# EAGLE design nRF52810 Beacon (EAGLE 9.6.2)
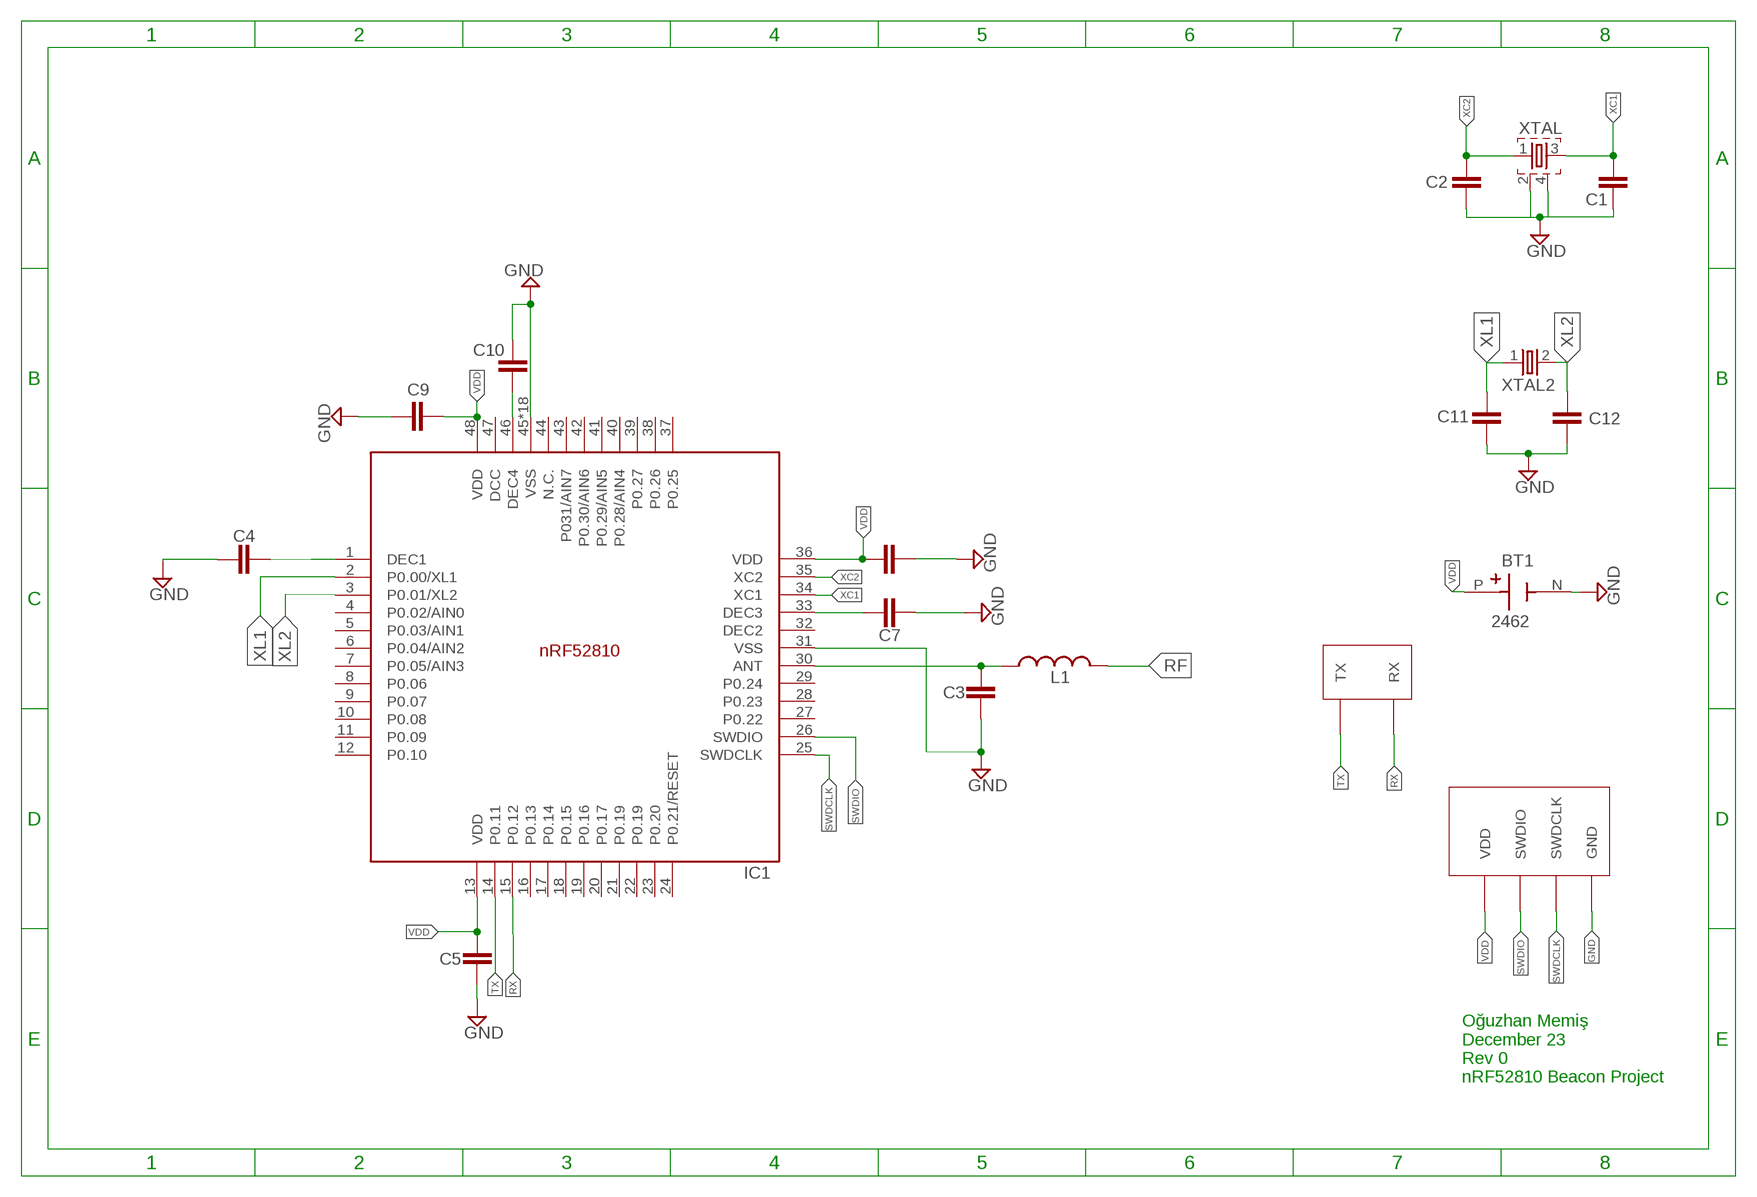
[diagram p0: schematic, sheet 1]

## Parts
BT1  2462  [BAT_2462]
C1  12pF  CAPACITOR_0402_N  [RESC0402_N]
C2  12pF  CAPACITOR_0402_N  [RESC0402_N]
C3  0.8pF  CAPACITOR_0402_N  [RESC0402_N]
C4  100nF  CAPACITOR_0402_N  [RESC0402_N]
C5  100nF  CAPACITOR_0402_N  [RESC0402_N]
C7  100pF  CAPACITOR_0402_N  [RESC0402_N]
C8  100nF  CAPACITOR_0402_N  [RESC0402_N]
C9  4.7uF  CAPACITOR_0603_N  [RESC0603_N]
C10  1uF  CAPACITOR_0603_N  [RESC0603_N]
C11  12pF  CAPACITOR_0402_N  [RESC0402_N]
C12  12pF  CAPACITOR_0402_N  [RESC0402_N]
IC1  NRF52810_QF48  [QFN40P600X600X90-48_N]
L1  3.9nF  INDUCTOR_0402_N  [RESC0402_N]
U$1  SWD  [SWD]
U$2  UART  [UART]
XTAL  32MHz SMD2016  XTAL_32MHZ  [BT-XTAL_2016_N]
XTAL2  32KHz  XTAL_32KHZ  [XTAL_3215_N]

## Nets
GND: BT1.N(NEG) C1.1 C2.1 C3.2 C4.1 C5.2 C7.2 C8.2 C9.1 C10.2 C11.1 C12.1 IC1.31(VSS) IC1.45(VSS) IC1.PAD(VSS) IC1.PAD@VIA01(VSS) IC1.PAD@VIA02(VSS) IC1.PAD@VIA03(VSS) IC1.PAD@VIA04(VSS) IC1.PAD@VIA05(VSS) IC1.PAD@VIA06(VSS) IC1.PAD@VIA07(VSS) IC1.PAD@VIA08(VSS) IC1.PAD@VIA09(VSS) IC1.PAD@VIA10(VSS) IC1.PAD@VIA11(VSS) IC1.PAD@VIA12(VSS) IC1.PAD@VIA13(VSS) IC1.PAD@VIA14(VSS) IC1.PAD@VIA15(VSS) IC1.PAD@VIA16(VSS) U$1.GND XTAL.2 XTAL.4
N$1: C10.1 IC1.46(DEC4)
N$3: C7.1 IC1.33(DEC3)
N$6: C4.2 IC1.1(DEC1)
N$11: C3.1 IC1.30(ANT) L1.1
RF: L1.2
RX: IC1.15(P0.12) U$2.RX
SWDCLK: IC1.25(SWDCLK) U$1.SWDCLK
SWDIO: IC1.26(SWDIO) U$1.SWDIO
TX: IC1.14(P0.11) U$2.TX
VDD: BT1.P(POS) C5.1 C8.1 C9.2 IC1.13(VDD) IC1.36(VDD) IC1.48(VDD) U$1.VDD
XC1: C1.2 IC1.34(XC1) XTAL.3
XC2: C2.2 IC1.35(XC2) XTAL.1
XL1: C11.2 IC1.2(P0.00/XL1) XTAL2.1
XL2: C12.2 IC1.3(P0.01/XL2) XTAL2.2
Unconnected: IC1.4(P0.02/AIN0) IC1.5(P0.03/AIN1) IC1.6(P0.04/AIN2) IC1.7(P0.05/AIN3) IC1.8(P0.06) IC1.9(P0.07) IC1.10(P0.08) IC1.11(P0.09) IC1.12(P0.10) IC1.16(P0.13) IC1.17(P0.14) IC1.18(P0.15) IC1.19(P0.16) IC1.20(P0.17) IC1.21(P0.19) IC1.22(P0.19) IC1.23(P0.20) IC1.24(P0.21/RESET) IC1.27(P0.22) IC1.28(P0.23) IC1.29(P0.24) IC1.32(DEC2) IC1.37(P0.25) IC1.38(P0.26) IC1.39(P0.27) IC1.40(P0.28/AIN4) IC1.41(P0.29/AIN5) IC1.42(P0.30/AIN6) IC1.43(P031/AIN7) IC1.44(N.C.) IC1.47(DCC)

## Notes on the sheet
- Oğuzhan Memiş 
  December 23
  Rev 0
  nRF52810 Beacon Project

## Library data of the parts
BT1 = 2462:2462: Check availability <https://pricing.snapeda.com/parts/2462/Keystone/view-part?ref=eda>; AVAILABILITY: In Stock; CHECK_PRICES: https://www.snapeda.com/parts/2462/Keystone+Electronics/view-part/?ref=eda; DESCRIPTION: Battery Holder, AA, Polypropylene, PC Mount, 2, Spring, PC Lug | Keystone Electronics 2462; MF: Keystone; MP: 2462; PACKAGE: None; PRICE: None; SNAPEDA_LINK: https://www.snapeda.com/parts/2462/Keystone+Electronics/view-part/?ref=snap
C1-C5 C7-C12 = Nordic_nRF:CAPACITOR: Generic chip capacitor
IC1 = Nordic_nRF:NRF52810_QF48: nRF52810 Features Single chip, highly flexible, 2.4 GHz multi-protocol SoC 32-bit ARM Cortex-M4 Processor 1.7v to 3.6v operation 192kB flash + 24kB RAM Supports concurrent Bluetooth low energy/ANT protocol operation Up to +4dBm output power -96dBm sensitivity, Bluetooth low energy Thread safe and run-time protected Event driven API On air compatible with nRF24L and nRF24AP series 2 data rates (2Mbps/1Mbps) PPI - maximum flexibility for power-efficient applications and code simplification Automated power management system with automatic power management of each peripheral Configurable I/O mapping for analog and digital I/O 1 x Master/Slave SPI 1 x Two-wire interface (I²C) UART (RTS/CTS) 1 x PWM (4 channels) AES HW encryption 8-channel 10/12-bit ADC Quadrature decoder 64-level analog comparator Real Time Counter (RTC) Digital microphone interface (PDM) On-chip balun Applications Bluetooth 5 connectivity processor Industrial sensors and actuators Wearables SmartHome sensors computer peripherals RF smart remotes Airfuel (A4WP) wireless charging Beacons Sports and fitness sensors Connected health products Smart watches RC Toys Interactive games Building automation
L1 = Nordic_nRF:INDUCTOR: Generic chip inductor
U$1 = 2023Poi:SWD
U$2 = 2023Poi:UART
XTAL = Nordic_nRF:XTAL_32MHZ
XTAL2 = Nordic_nRF:XTAL_32KHZ

## Board
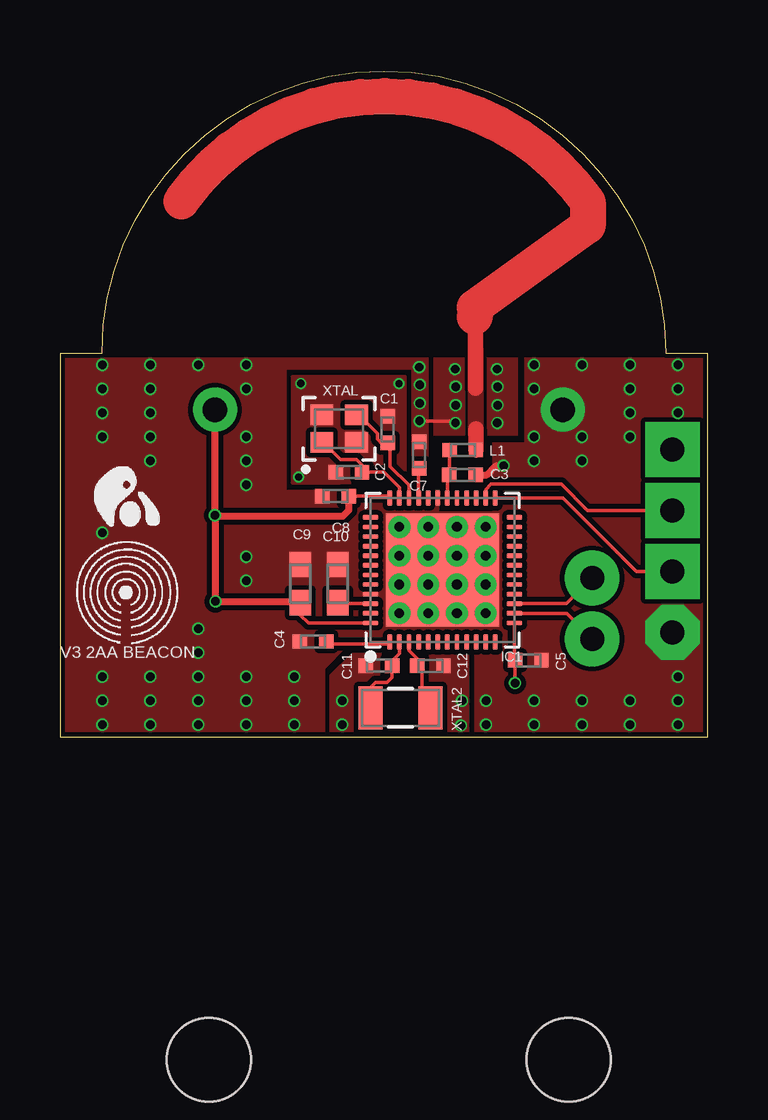
[diagram p1: board, top side]
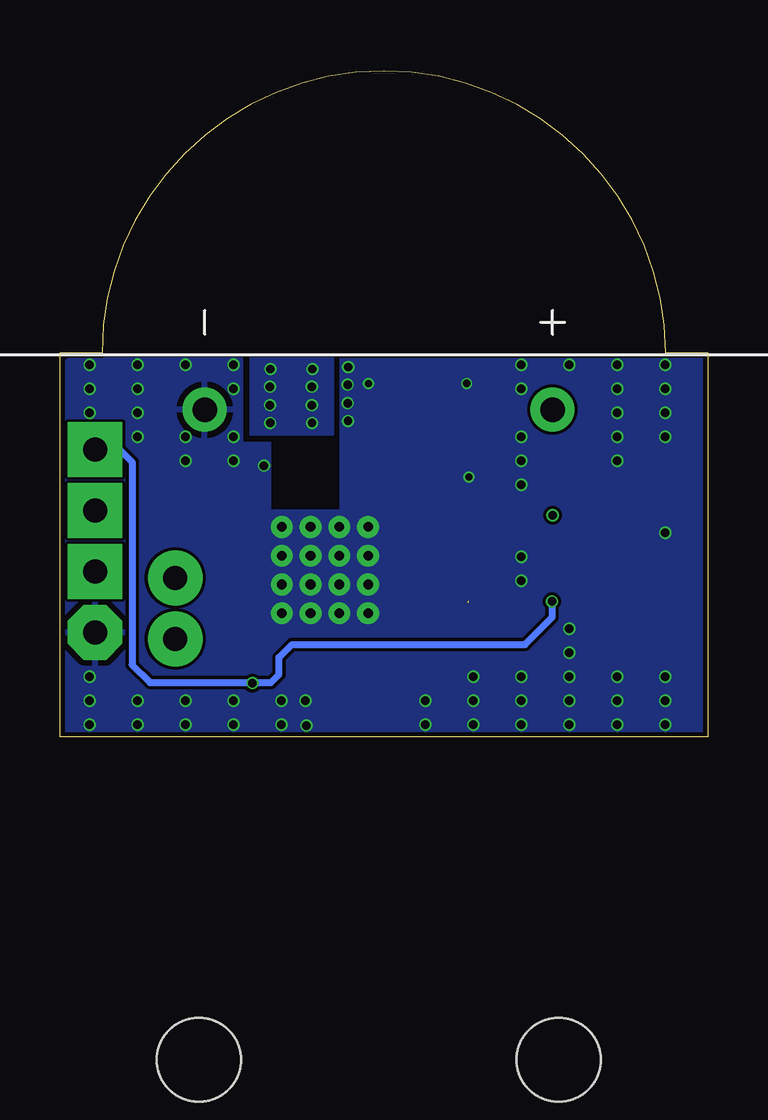
[diagram p2: board, bottom side, seen from below]

Size 27 x 27.75 mm. Coordinates in mm from the lower left corner, seen from the top.
Outline: 0,0 27,0 27,16 25.25,16 arc180 1.75,16 0,16 0,0
Copper layers (1*16): Top 0.035mm / dielectric 1.6mm / Bottom 0.035mm
Design rules "jlcpcb-2layers": minimum track width 5mil, minimum drill 0.3mm, track to track 5mil, track to pad 5mil, pad to pad 5mil, via to via 5mil, smd to smd 5mil, copper to edge 0.2mm, drill to drill 6mil, minimum pad ring 10mil, minimum via ring 3mil, stop-mask expansion 4mil, vias tented up to drill 0mil, thermal gap 10mil

### Footprints (pad centres in the part's own frame; a part is rotated, then mirrored left to right if it is on the bottom)
BAT_2462 = drill 1.02: N 27.1,7.25; P 27.1,-7.25 | hole 3.5: 0,7.5; 0,-7.5
RESC0402_N = smd 0.6 x 0.6: 1 -0.55,0; 2 0.55,0
RESC0603_N = smd 1.05 x 0.9: 1 -0.8,0; 2 0.8,0
QFN40P600X600X90-48_N = smd 0.65 x 0.2: 1 -3,2.2; 2 -3,1.8; 3 -3,1.4; 4 -3,1; 5 -3,0.6; 6 -3,0.2; 7 -3,-0.2; 8 -3,-0.6; 9 -3,-1; 10 -3,-1.4; 11 -3,-1.8; 12 -3,-2.2; 25 3,-2.2; 26 3,-1.8; 27 3,-1.4; 28 3,-1; 29 3,-0.6; 30 3,-0.2; 31 3,0.2; 32 3,0.6; 33 3,1; 34 3,1.4; 35 3,1.8; 36 3,2.2 | smd 0.2 x 0.65: 13 -2.2,-3; 14 -1.8,-3; 15 -1.4,-3; 16 -1,-3; 17 -0.6,-3; 18 -0.2,-3; 19 0.2,-3; 20 0.6,-3; 21 1,-3; 22 1.4,-3; 23 1.8,-3; 24 2.2,-3; 37 2.2,3; 38 1.8,3; 39 1.4,3; 40 1,3; 41 0.6,3; 42 0.2,3; 43 -0.2,3; 44 -0.6,3; 45 -1,3; 46 -1.4,3; 47 -1.8,3; 48 -2.2,3 | smd 4.7 x 4.7: PAD 0,0 | drill 0.4: PAD@VIA01 -1.8,1.8; PAD@VIA02 -1.8,0.6; PAD@VIA03 -1.8,-0.6; PAD@VIA04 -1.8,-1.8; PAD@VIA05 -0.6,1.8; PAD@VIA06 -0.6,0.6; PAD@VIA07 -0.6,-0.6; PAD@VIA08 -0.6,-1.8; PAD@VIA09 0.6,1.8; PAD@VIA10 0.6,0.6; PAD@VIA11 0.6,-0.6; PAD@VIA12 0.6,-1.8; PAD@VIA13 1.8,1.8; PAD@VIA14 1.8,0.6; PAD@VIA15 1.8,-0.6; PAD@VIA16 1.8,-1.8
SWD = drill 1 pad 2.28 octagon: GND 7.62,0 | drill 1 pad 2.28 square: SWDCLK 5.08,0; SWDIO 2.54,0; VDD 0,0
UART = drill 1 pad 2.28: RX 0,0; TX 2.54,0
BT-XTAL_2016_N = smd 0.95 x 0.85: 1 -0.725,-0.575; 2 0.725,-0.575; 3 0.725,0.575; 4 -0.725,0.575
XTAL_3215_N = smd 1 x 1.8: 1 -1.25,0; 2 1.25,0

### Placement (x,y rotation side)
BT1  13.71,-13.47 90 bottom
C1  13.66,12.8 270 top
C2  12.04,11.03 0 top
C3  16.79,10.91 0 top
C4  10.55,3.97 0 top
C5  19.52,3.19 0 top
C7  14.97,11.74 90 top
C8  11.49,10.02 180 top
C9  10.02,6.38 270 top
C10  11.59,6.38 90 top
C11  13.3,2.96 0 top
C12  15.44,2.96 180 top
IC1  15.95,6.94 90 top
L1  16.79,11.95 0 top
U$1  25.54,11.97 270 top
U$2  22.19,6.62 270 top
U$3  [POILOGO]  2.13,8.74 0 top
U$4  [IBEACON]  2.46,5.99 0 top
XTAL  11.64,12.84 0 top
XTAL2  14.2,1.21 0 top

### Tracks (layer width: path | path; a pad name or v marks a point on that pad's centre or on a via)
GND  (via drill 0.3, 0.35)
  Top 0.152: v14.99,13.16 16.41,13.16 v16.49,13.08
  Top 0.3: C3.2 17.8,10.91 18.18,11.3 v18.5,11.3
  other vias: 10.04,14.73 14.13,14.71 9.95,10.82 18.25,13.82 18.25,14.59 18.22,15.32 18.23,13.08 16.5,13.82 16.5,14.59 16.48,15.32 14.98,15.41 15,14.67 15,13.9 11.76,1.5 11.76,0.5 16.76,1.5 16.73,0.47 17.76,1.5 17.76,0.5 1.76,15.5 1.76,14.5 1.76,13.5 1.76,12.5 3.76,15.5 3.76,14.5 3.76,13.5 3.76,12.5 3.76,11.5 5.76,15.5 7.76,15.5 7.76,14.5 7.76,12.5 7.76,11.5 7.76,10.5 1.76,8.5 7.76,7.5 7.76,6.5 5.76,4.5 5.76,3.5 9.76,2.5 9.76,1.5 9.76,0.5 7.76,2.5 7.76,1.5 7.76,0.5 5.76,2.5 5.76,1.5 5.76,0.5 3.76,0.5 3.76,1.5 3.76,2.5 1.76,2.5 1.76,1.5 1.76,0.5 19.76,1.5 19.76,0.5 21.76,1.5 21.76,0.5 23.76,1.5 23.76,0.5 25.76,0.5 25.76,1.5 25.76,2.5 19.76,11.5 21.76,11.5 19.76,12.5 21.76,12.5 23.76,12.5 19.76,14.5 19.76,15.5 21.76,15.5 23.76,15.5 23.76,14.5 23.76,13.5 25.76,15.5 25.76,14.5 25.76,13.5
  pour Top (isolate 0.2, no thermals): 9.71,15.02 9.71,10.57 14.39,10.57 14.39,15.02
  pour Top (isolate 0.2, no thermals): 12.19,3.42 11.31,2.54 11.31,0.05 16.98,0.05 16.98,3.42
  pour Top (isolate 0.2, no thermals): 14.65,10.77 14.65,15.29 9.44,15.29 9.44,10.29 9.45,10.28 15.78,10.28 15.81,10.3 15.81,9.39 15.82,9.38 18.02,9.38 18.02,12.26 19.36,12.26 19.36,15.81 26.92,15.81 26.92,0.09 26.93,0.07 17.3,0.07 17.29,0.06 17.29,3.73 11.96,3.73 11.04,2.82 11.04,0.07 0.06,0.07 0.06,15.81 15.37,15.81 15.37,10.77
  pour Top: 17.8,15.81 17.8,12.55 19.1,12.55 19.1,15.81
  pour Top: 15.58,15.81 15.58,12.55 16.88,12.55 16.88,15.81
  pour Bottom: 0.13,15.79 15.34,15.79 15.34,9.48 15.35,9.47 18.19,9.47 18.19,9.47 18.19,12.28 19.36,12.28 19.36,15.81 26.66,15.81 26.94,15.56 26.94,0.06 0.13,0.06
  pour Bottom: 15.58,15.81 15.58,12.61 15.59,12.55 19.1,12.55 19.1,15.81
N$1
  Top 0.152: IC1.46 11.62,5.54 C10.1
N$3
  Top 0.152: IC1.33 14.95,11.18 C7.1
N$6
  Top 0.152: IC1.1 13.67,3.87 11.21,3.87 C4.2
N$11
  Top 0.152: IC1.30 16.15,10.83 C3.1 L1.1
RF
  Top 0.65: L1.2 17.34,12.83 | 17.3,17.5 17.33,17.42 17.33,14.54
  Top 1.5: 5.05,22.32 arc-110 22,22.28 22,21.3 17.3,17.91 17.3,17.5
  pour Top: 17.01,12.55 17.66,12.55 17.66,16.2 17.01,16.2
RX
  Top 0.152: IC1.15 21.12,5.54 U$2.RX
SWDCLK
  Top 0.152: IC1.25 20.97,9.94 24.03,6.89 U$1.SWDCLK
SWDIO
  Top 0.152: IC1.26 17.75,10.31 17.97,10.53 20.9,10.53 22,9.43 U$1.SWDIO
TX
  Top 0.152: IC1.14 21.13,5.14 U$2.TX
VDD  (via drill 0.35)  (1 unrouted)
  Top 0.152: C9.2 10.02,5.08 10.36,4.74 IC1.48 | IC1.36 13.67,10.02 C8.1 | C5.1 v18.97,2.24 v18.98,2.23
  Top 0.154: IC1.13 18.95,3.19 C5.1
  Top 0.3: C8.1 12.04,9.44 11.79,9.18 6.5,9.18 v6.46,9.23 | v6.46,9.23 BT1.P | v6.46,9.23 6.46,5.66 v6.48,5.64 9.96,5.64
  Bottom 0.152: 18.99,2.25 v18.98,2.23 18.95,2.26
  Bottom 0.3: U$1.VDD 24.51,11.97 23.99,11.45 23.99,3 23.24,2.25 18.99,2.25 | 18.95,2.26 18.21,2.26 17.87,2.6 17.87,3.3 17.33,3.85 7.61,3.85 6.48,4.98 v6.48,5.64
XC1
  Top 0.152: IC1.34 14.55,10.48 13.77,11.27 13.77,12.2 13.66,12.2 | 13.66,12.2 C1.2 | XTAL.3 12.46,13.42 13.24,12.64 13.24,12.4 13.43,12.2 13.66,12.2
XC2
  Top 0.152: IC1.35 14.15,10.39 13.52,11.03 C2.2 12.59,11.33 12.37,11.56 11.71,11.56 10.99,12.27 XTAL.1
XL1
  Top 0.152: 13.85,2.88 13.85,2.47 13.64,2.26 13.15,2.26 12.95,2.06 XTAL2.1
  Top 0.154: IC1.2 14.15,3.47 13.85,3.17 C11.2
  Top 0.3: C11.2 13.85,2.88
XL2
  Top 0.152: IC1.3 14.55,3.6 14.89,3.26 C12.2 15.09,2.76 15.09,1.57 XTAL2.2

### Text on the board
tNames: V3 2AA BEACON